# EAGLE design console2 (EAGLE 8.0.2)
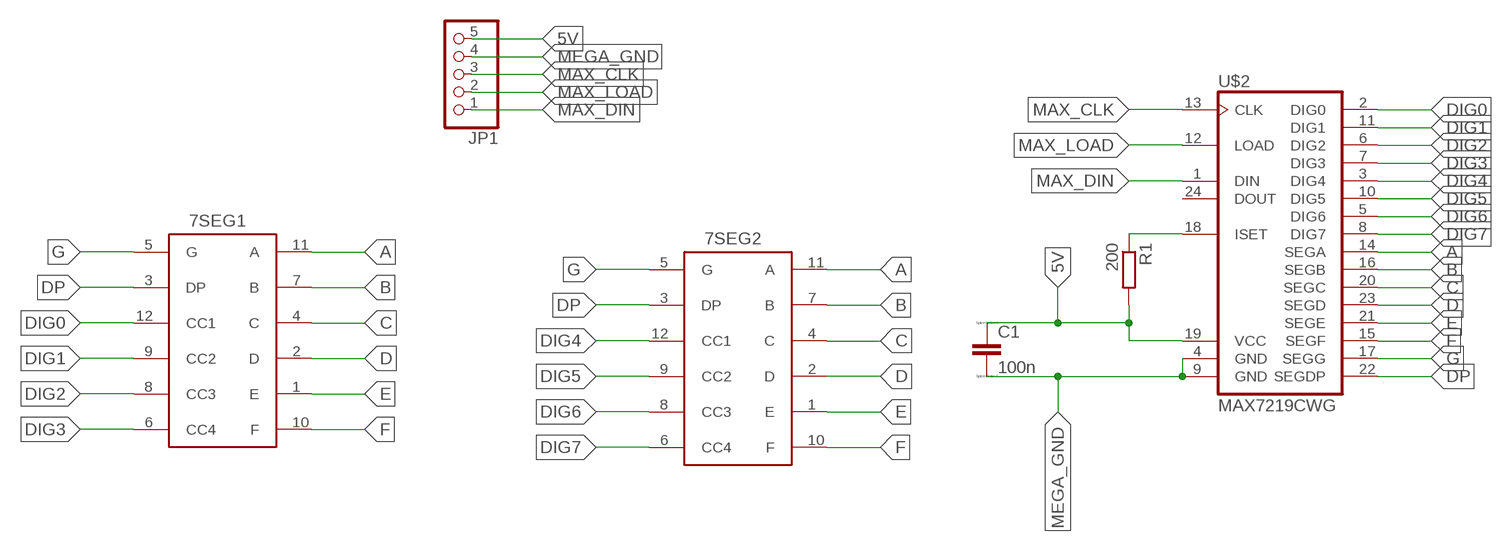
[diagram p0: schematic, sheet 1]

## Parts
7SEG1  7SEG_DEV  [7SEG_PACK]
7SEG2  7SEG_DEV  [7SEG_PACK]
C1  100n  C  [C0805]
JP1  PINHD-1X5  [1X05]
R1  200  R-EU_M3516  [M3516]
U$2  MAX7219CWG  [SO24L]

## Nets
5V: C1.1 JP1.5 R1.2 U$2.19(VCC)
A: 7SEG1.11(A) 7SEG2.11(A) U$2.14(SEGA)
B: 7SEG1.7(B) 7SEG2.7(B) U$2.16(SEGB)
C: 7SEG1.4(C) 7SEG2.4(C) U$2.20(SEGC)
D: 7SEG1.2(D) 7SEG2.2(D) U$2.23(SEGD)
DIG0: 7SEG1.12(CC1) U$2.2(DIG0)
DIG1: 7SEG1.9(CC2) U$2.11(DIG1)
DIG2: 7SEG1.8(CC3) U$2.6(DIG2)
DIG3: 7SEG1.6(CC4) U$2.7(DIG3)
DIG4: 7SEG2.12(CC1) U$2.3(DIG4)
DIG5: 7SEG2.9(CC2) U$2.10(DIG5)
DIG6: 7SEG2.8(CC3) U$2.5(DIG6)
DIG7: 7SEG2.6(CC4) U$2.8(DIG7)
DP: 7SEG1.3(DP) 7SEG2.3(DP) U$2.22(SEGDP)
E: 7SEG1.1(E) 7SEG2.1(E) U$2.21(SEGE)
F: 7SEG1.10(F) 7SEG2.10(F) U$2.15(SEGF)
G: 7SEG1.5(G) 7SEG2.5(G) U$2.17(SEGG)
MAX_CLK: JP1.3 U$2.13(CLK)
MAX_DIN: JP1.1 U$2.1(DIN)
MAX_ISET: R1.1 U$2.18(ISET)
MAX_LOAD: JP1.2 U$2.12(LOAD)
MEGA_GND: C1.2 JP1.4 U$2.4(GND) U$2.9(GND)
Unconnected: U$2.24(DOUT)

## Library data of the parts
7SEG1 7SEG2 = seven_segment:7SEG_DEV
C1 = eagle-ltspice:C: CAPACITOR, European symbol; SPICEMODEL: NONE; SPICEPREFIX: C
JP1 = pinhead:PINHD-1X5: PIN HEADER
R1 = resistor:R-EU_: RESISTOR, European symbol
U$2 = max7219:MAX7219CWG

## Board
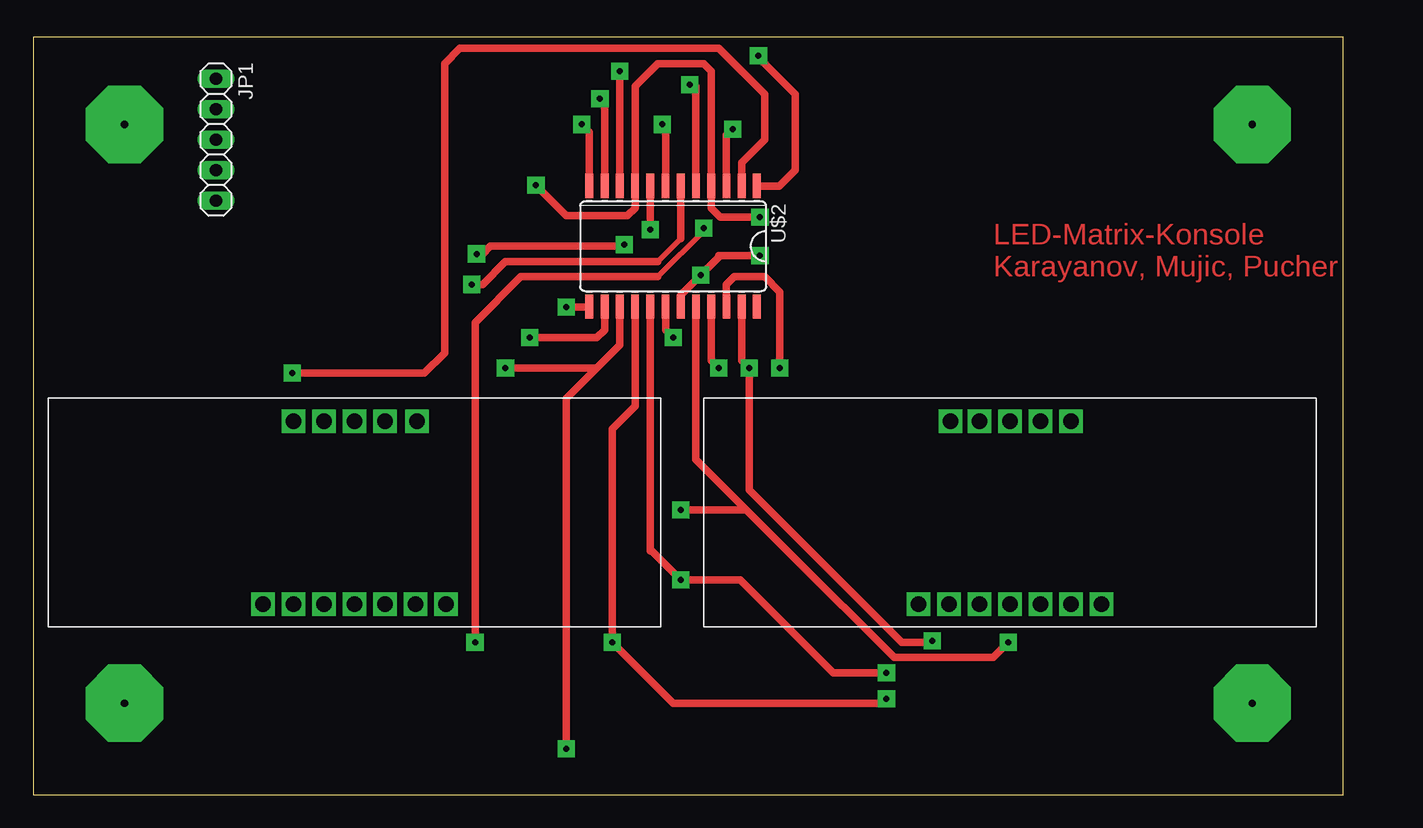
[diagram p1: board, top side]
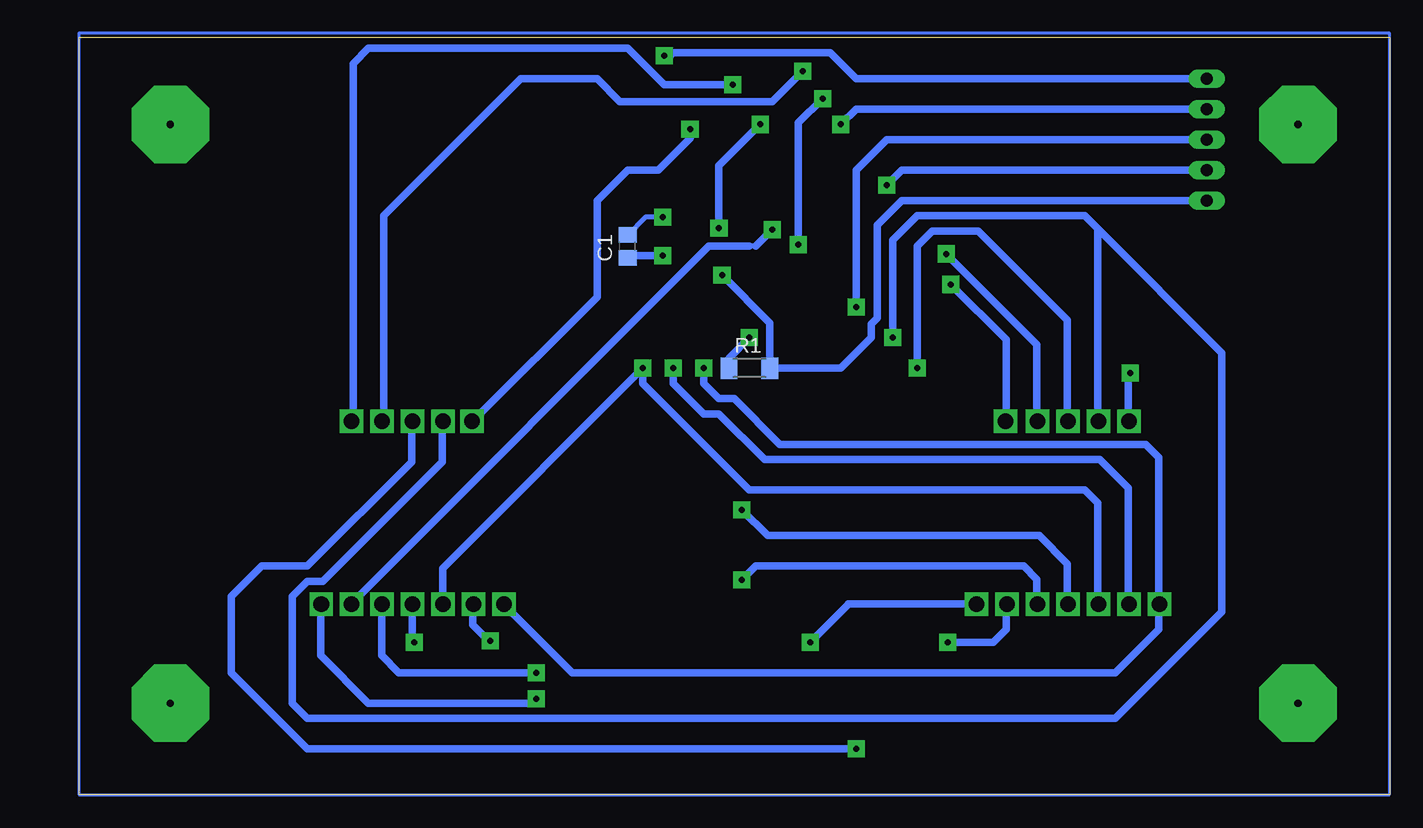
[diagram p2: board, bottom side, seen from below]

Size 109.2 x 63.17 mm. Coordinates in mm from the lower left corner, seen from the top.
Outline: 0,0 109.2,0 109.2,63.17 0,63.17 0,0
Copper layers (1*16): Top 0.035mm / dielectric 1.5mm / Bottom 0.035mm
Design rules "default": minimum track width 10mil, minimum drill 24mil, track to track 8mil, track to pad 8mil, pad to pad 8mil, via to via 8mil, smd to smd 8mil, copper to edge 40mil, drill to drill 8mil, minimum pad ring 10mil, minimum via ring 8mil, stop-mask expansion 4mil, vias tented up to drill 0mil, thermal gap 10mil

### Footprints (pad centres in the part's own frame; a part is rotated, then mirrored left to right if it is on the bottom)
7SEG_PACK = drill 0.635 pad 1.016 square: 1 17.958,1.93; 2 20.498,1.93; 3 23.038,1.93; 4 25.578,1.93; 5 28.118,1.93; 6 30.658,1.93; 7 33.198,1.93; 8 30.683,17.17; 9 28.143,17.17; 10 25.603,17.17; 11 23.063,17.17; 12 20.523,17.17
C0805 = smd 1.3 x 1.5: 1 -0.95,0; 2 0.95,0
1X05 = drill 1.016 long: 1 -5.08,0; 2 -2.54,0; 3 0,0; 4 2.54,0; 5 5.08,0
M3516 = smd 1.4 x 1.8: 1 -1.7,0; 2 1.7,0
SO24L = smd 0.66 x 2.032: 1 -6.985,-5.029; 2 -5.715,-5.029; 3 -4.445,-5.029; 4 -3.175,-5.029; 5 -1.905,-5.029; 6 -0.635,-5.029; 7 0.635,-5.029; 8 1.905,-5.029; 9 3.175,-5.029; 10 4.445,-5.029; 11 5.715,-5.029; 12 6.985,-5.029; 13 6.985,5.029; 14 5.715,5.029; 15 4.445,5.029; 16 3.175,5.029; 17 1.905,5.029; 18 0.635,5.029; 19 -0.635,5.029; 20 -1.905,5.029; 21 -3.175,5.029; 22 -4.445,5.029; 23 -5.715,5.029; 24 -6.985,5.029

### Placement (x,y rotation side)
7SEG1  1.27,13.97 0 top
7SEG2  55.88,13.97 0 top
C1  63.5,45.72 90 bottom
JP1  15.24,54.61 270 top
R1  53.34,35.56 0 bottom
U$2  53.34,45.72 180 top

### Tracks (layer width: path | path; a pad name or v marks a point on that pad's centre or on a via)
5V  (via drill 0.5 pad 1.42)
  Top 0.406: 58.42,44.96 58.93,44.96 | 57.15,44.83 57.15,44.96 | 53.98,41.66 U$2.19
  Top 0.61: 57.15,44.96 58.42,44.96 v60.58,44.96 | 57.15,44.83 v55.63,43.31 53.98,41.66
  Bottom 0.61: 63.18,44.45 C1.1 63.31,44.96 v60.58,44.96 | JP1.5 40.64,49.53 42.67,47.5 42.67,39.75 43.18,39.24 43.18,38.1 45.72,35.56 R1.2 51.64,39.32 v55.63,43.31
A  (via drill 0.5 pad 1.42)
  Top 0.61: v41.4,38.1 46.99,38.1 47.62,38.73 U$2.14
  Bottom 0.61: 24.33,31.55 7SEG1.11 24.33,47.19 | 7SEG2.11 78.94,27.74 88.9,17.78 90.17,17.78 91.44,16.51 91.44,7.62 90.17,6.35 22.86,6.35 13.97,15.24 13.97,36.83 24.33,47.19 | 24.33,47.19 25.4,48.26 39.37,48.26 41.4,46.23 v41.4,38.1
B  (via drill 0.5 pad 1.42)
  Top 0.61: U$2.16 50.16,32.38 48.26,30.48 v48.26,12.7 53.34,7.62 70.74,7.62 v71.12,8
  Bottom 0.61: 7SEG2.7 89.08,11.61 85.09,7.62 71.5,7.62 v71.12,8 | 7SEG1.7 45.11,15.9 45.11,15.85 v48.26,12.7
C  (via drill 0.5 pad 1.42)
  Top 0.61: U$2.20 55.24,27.94 63.18,20 | 63.18,20 71.75,11.43 80.01,11.43 v81.28,12.7 | v53.98,23.75 59.44,23.75 63.18,20
  Bottom 0.61: v81.28,12.7 81.46,12.88 7SEG2.4 | 7SEG1.4 26.85,19.23 29.21,21.59 51.82,21.59 v53.98,23.75
D  (via drill 0.5 pad 1.42)
  Top 0.61: U$2.23 59.05,36.2 v59.69,35.56 59.69,25.4 72.39,12.7 74.8,12.7 v74.93,12.83
  Bottom 0.61: v59.69,35.56 59.69,34.29 57.15,31.75 55.88,31.75 52.07,27.94 24.13,27.94 21.77,25.58 7SEG1.2 | v74.93,12.83 75.06,12.83 76.38,14.15 | 76.38,14.15 76.38,14.39 | 7SEG2.2 76.38,14.15
DIG0  (via drill 0.5 pad 1.42)
  Top 0.61: U$2.2 59.05,52.7 60.96,54.61 60.96,58.42 57.15,62.23 35.56,62.23 34.29,60.96 34.29,36.83 32.61,35.15 v21.59,35.15
  Bottom 0.61: 7SEG1.12 21.79,34.95 v21.59,35.15
DIG1  (via drill 0.5 pad 1.42)
  Top 0.61: v36.96,45.09 37.47,45.09 38.1,45.72 49.15,45.72 v49.28,45.85 | v47.24,58.04 47.62,57.66 U$2.11
  Bottom 0.61: v49.28,45.85 49.28,55.63 49.28,56.01 v47.24,58.04 | 7SEG1.9 29.41,37.54 v36.96,45.09
DIG2  (via drill 0.5 pad 1.42)
  Top 0.406: 52.07,44.45 53.98,46.35
  Top 0.61: 52.07,44.45 39.37,44.45 37.47,42.55 v36.58,42.55 | 53.98,46.35 U$2.6
  Bottom 0.61: 7SEG1.8 31.95,37.92 v36.58,42.55
DIG3  (via drill 0.5 pad 1.42)
  Top 0.406: v52.45,55.88 52.7,55.63 | v55.88,47.24 55.88,46.99 52.07,43.18
  Top 0.61: 52.07,43.18 40.64,43.18 36.83,39.37 v36.83,12.7 | 52.7,55.63 U$2.7
  Bottom 0.61: 31.75,15.72 7SEG1.6 31.93,13.79 33.02,12.7 v36.83,12.7 | v52.45,55.88 55.88,52.45 v55.88,47.24
DIG4  (via drill 0.5 pad 1.42)
  Top 0.61: v58.29,55.5 57.78,54.99 U$2.3
  Bottom 0.61: 7SEG2.12 66.04,41.5 66.04,49.53 63.5,52.07 60.96,52.07 58.29,54.74 v58.29,55.5
DIG5  (via drill 0.5 pad 1.42)
  Top 0.61: v48.9,60.33 U$2.10
  Bottom 0.61: 7SEG2.9 83.82,31.34 83.82,48.26 72.39,59.69 66.04,59.69 64.14,57.78 51.44,57.78 v48.9,60.33
DIG6  (via drill 0.5 pad 1.42)
  Top 0.406: v54.74,59.18 55.12,59.18 55.24,59.05
  Top 0.61: 55.24,59.05 U$2.5
  Bottom 0.61: 7SEG2.8 86.36,31.34 86.36,60.96 85.09,62.23 63.5,62.23 60.45,59.18 v54.74,59.18
DIG7  (via drill 0.5 pad 1.42)
  Top 0.61: v51.44,47.12 U$2.8
  Bottom 0.406: 52.83,45.72 53.34,45.72
  Bottom 0.61: 7SEG2.6 56.72,45.72 53.34,45.72 | v51.44,47.12 52.83,45.72
DP  (via drill 0.5 pad 1.42)
  Top 0.61: v62.23,35.56 62.23,41.91 60.96,43.18 58.42,43.18 57.78,42.55 U$2.22
  Bottom 0.61: 78.74,16.08 7SEG2.3 78.92,18.87 v62.23,35.56 62.23,34.29 53.34,25.4 25.4,25.4 24.31,24.31 7SEG1.3
E  (via drill 0.5 pad 1.42)
  Top 0.61: v57.15,35.56 56.52,36.2 U$2.21
  Bottom 0.61: v57.15,35.56 57.15,34.29 55.88,33.02 54.61,33.02 50.8,29.21 21.59,29.21 20.32,29.21 19.23,28.12 7SEG1.1 19.23,13.79 22.86,10.16 68.1,10.16 7SEG2.1
F  (via drill 0.5 pad 1.42)
  Top 0.61: 46.99,35.56 v39.37,35.56 | 46.99,35.56 48.9,37.47 U$2.15 | v44.45,3.81 44.45,33.02 46.99,35.56
  Bottom 0.61: v39.37,35.56 39.37,45.72 38.1,46.99 34.29,46.99 26.87,39.57 7SEG1.10 | 7SEG2.10 81.48,27.74 90.17,19.05 93.98,19.05 96.52,16.51 96.52,10.16 90.17,3.81 v44.45,3.81
G  (via drill 0.5 pad 1.42)
  Top 0.61: U$2.17 51.44,20.32 51.56,20.32 v53.98,17.91 58.93,17.91 66.67,10.16 v71.12,10.16
  Bottom 0.61: 7SEG2.5 84,11.61 82.55,10.16 v71.12,10.16 | 7SEG1.5 29.39,17.96 30.48,19.05 52.83,19.05 v53.98,17.91
MAX_CLK  (via drill 0.5 pad 1.42)
  Top 0.305: 46.3,40.64 U$2.13
  Top 0.61: v44.45,40.64 46.3,40.64
  Bottom 0.61: 16.51,54.61 JP1.3 41.91,54.61 44.45,52.07 v44.45,40.64
MAX_DIN  (via drill 0.5 pad 1.42)
  Top 0.61: U$2.1 62.18,50.75 63.5,52.07 63.5,58.42 60.45,61.47 v60.45,61.59
  Bottom 0.61: JP1.1 44.45,59.69 46.61,61.85 59.69,61.85 59.94,61.59 v60.45,61.59
MAX_ISET  (via drill 0.5 pad 1.42)
  Top 0.305: v53.34,38.1 52.7,38.73
  Top 0.61: 52.7,38.73 U$2.18
  Bottom 0.61: R1.1 55.04,36.4 v53.34,38.1
MAX_LOAD  (via drill 0.5 pad 1.42)
  Top 0.61: v45.72,55.88 46.35,55.24 U$2.12
  Bottom 0.61: 16.51,57.15 JP1.2 44.45,57.15 v45.72,55.88
MEGA_GND  (via drill 0.5 pad 1.42)
  Top 0.61: v60.58,48.13 57.28,48.13 56.52,48.9 U$2.4 56.52,60.33 55.88,60.96 52.07,60.96 50.16,59.05 U$2.9 50.16,48.9 49.53,48.26 44.45,48.26 v41.91,50.8
  Bottom 0.406: v60.58,48.13 62.04,48.13 C1.2
  Bottom 0.61: v41.91,50.8 40.64,52.07 JP1.4
N$1  (via drill 0.6 pad 6.45)
  other vias: 7.62,7.62
N$2  (via drill 0.6 pad 6.45)
  other vias: 101.6,7.62
N$3  (via drill 0.6 pad 6.45)
  other vias: 101.6,55.88
N$4  (via drill 0.6 pad 6.45)
  other vias: 7.62,55.88
N$5
  Bottom 0.254: 0,0 0,63.5 109.22,63.5 109.22,0 0,0
N$6  (via drill 1.3)
  other vias: 76.45,31.11
N$7  (via drill 1.3)
  other vias: 78.87,31.11
N$8  (via drill 1.3)
  other vias: 81.41,31.11
N$9  (via drill 1.3)
  other vias: 83.95,31.11
N$10  (via drill 1.3)
  other vias: 86.49,31.11
N$11  (via drill 1.3)
  other vias: 73.79,15.88
N$12  (via drill 1.3)
  other vias: 76.33,15.88
N$13  (via drill 1.3)
  other vias: 78.87,15.88
N$14  (via drill 1.3)
  other vias: 81.41,15.88
N$15  (via drill 1.3)
  other vias: 83.95,15.88
N$16  (via drill 1.3)
  other vias: 86.49,15.88
N$17  (via drill 1.3)
  other vias: 89.03,15.88
N$18  (via drill 1.3)
  other vias: 21.72,31.11
N$19  (via drill 1.3)
  other vias: 24.26,31.11
N$20  (via drill 1.3)
  other vias: 26.8,31.11
N$21  (via drill 1.3)
  other vias: 29.34,31.11
N$22  (via drill 1.3)
  other vias: 32,31.11
N$23  (via drill 1.3)
  other vias: 19.18,15.88
N$24  (via drill 1.3)
  other vias: 21.72,15.88
N$25  (via drill 1.3)
  other vias: 24.26,15.88
N$26  (via drill 1.3)
  other vias: 26.8,15.88
N$27  (via drill 1.3)
  other vias: 29.34,15.88
N$28  (via drill 1.3)
  other vias: 31.88,15.88
N$29  (via drill 1.3)
  other vias: 34.42,15.88

### Text on the board
Top: LED-Matrix-Konsole / Karayanov, Mujic, Pucher